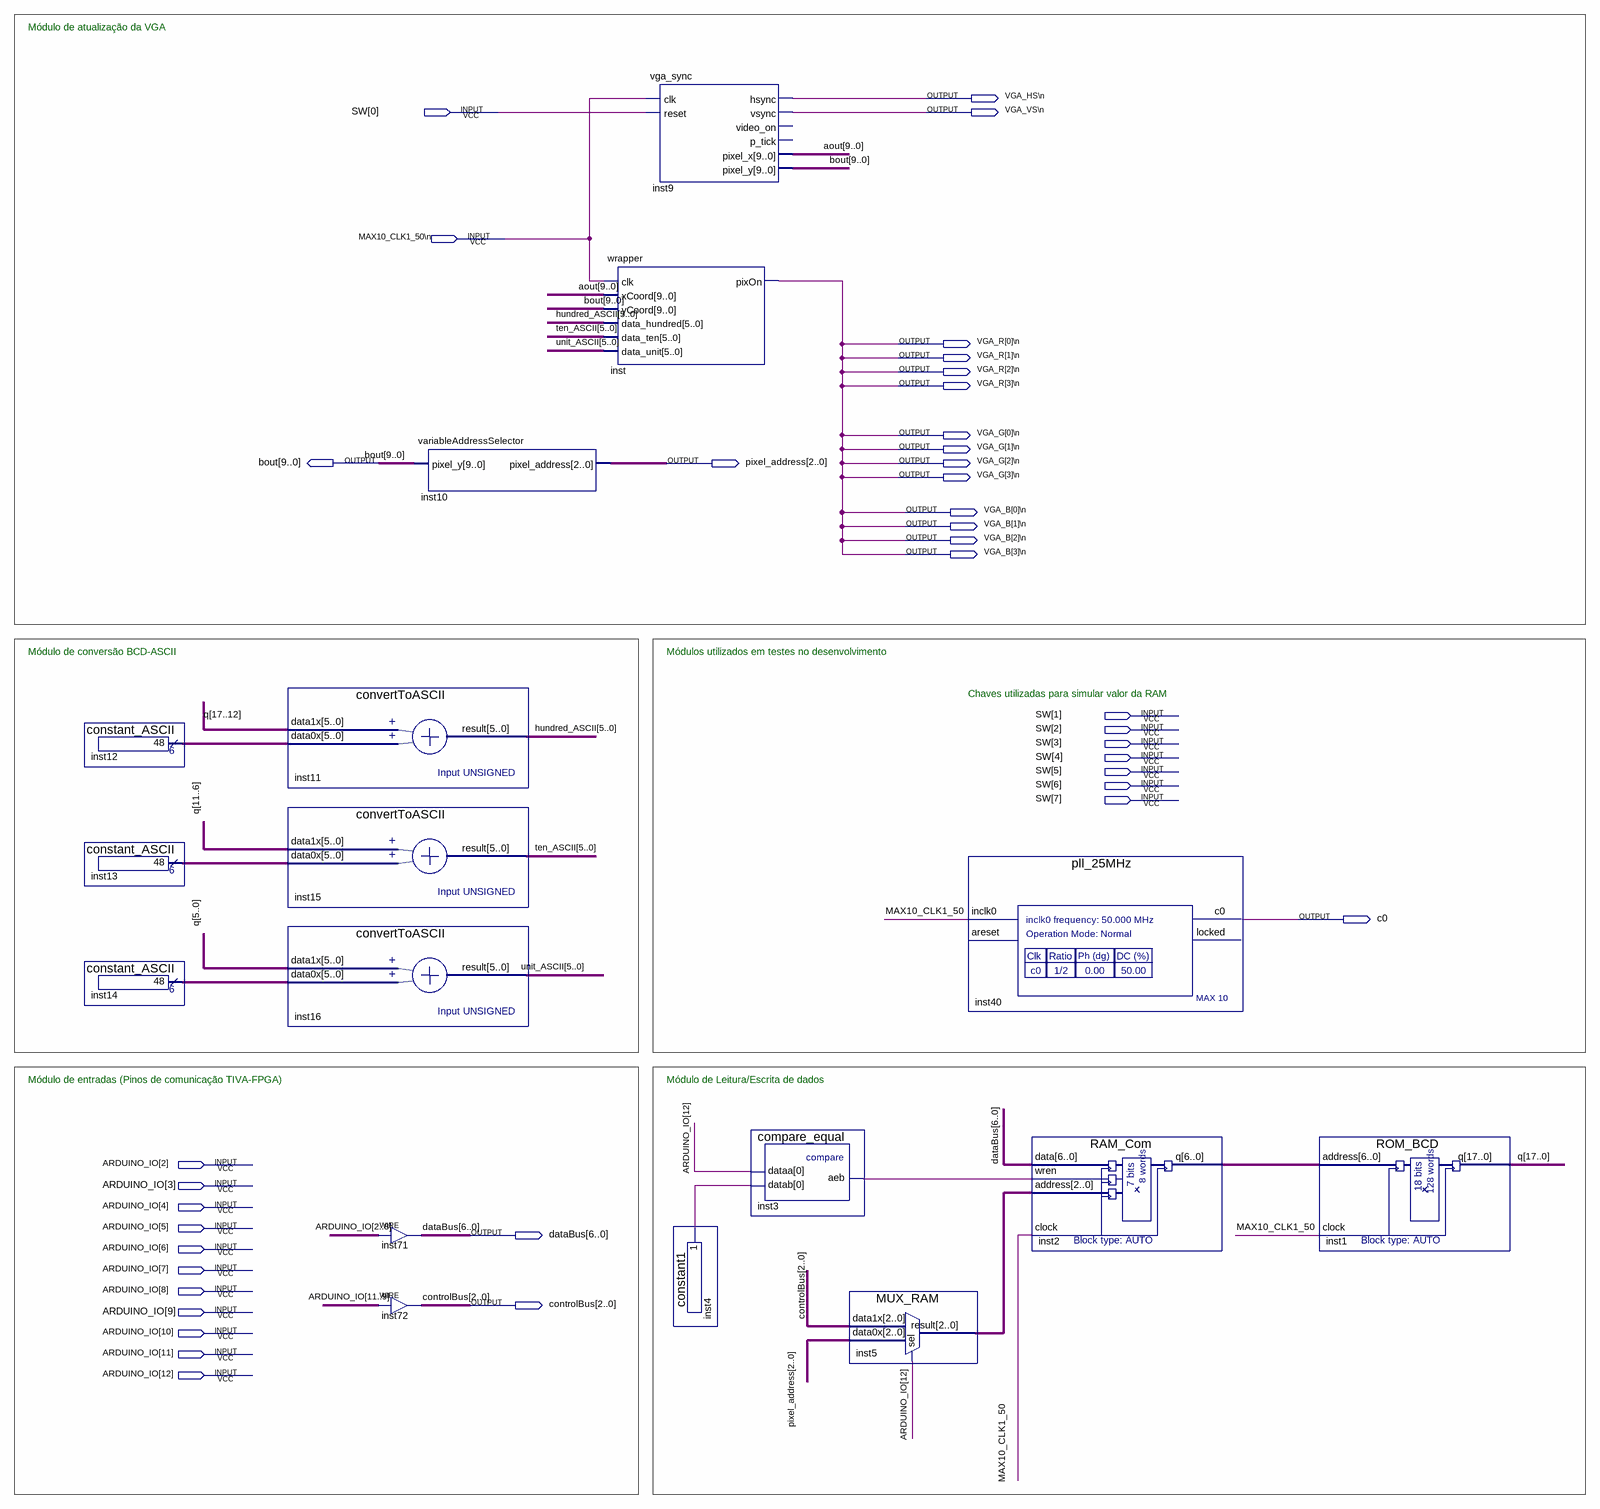
[diagram p0: schematic sheet]
// Quartus schematic Block3.bdf as structural Verilog: 17 symbols, 39 pins
module Block3 (
  input  [7:0] SW,
  input  \MAX10_CLK1_50\n ,
  input  [12:2] ARDUINO_IO,
  output \VGA_HS\n ,
  output \VGA_VS\n ,
  output \VGA_R[0]\n ,
  output \VGA_R[1]\n ,
  output \VGA_R[2]\n ,
  output \VGA_R[3]\n ,
  output \VGA_G[0]\n ,
  output \VGA_G[1]\n ,
  output [9:0] bout,
  output [2:0] pixel_address,
  output \VGA_G[2]\n ,
  output \VGA_G[3]\n ,
  output \VGA_B[0]\n ,
  output \VGA_B[1]\n ,
  output \VGA_B[2]\n ,
  output \VGA_B[3]\n ,
  output c0,
  output [6:0] dataBus,
  output [2:0] controlBus
);

  wire inst3_aeb, inst4_result, MAX10_CLK1_50;
  wire [2:0] inst5_result;
  wire [5:0] hundred_ASCII, inst12_result, inst13_result, inst14_result, ten_ASCII, unit_ASCII;
  wire [6:0] inst2_q;
  wire [9:0] aout;
  wire [17:0] q;

  constant_ASCII inst12 (.result(inst12_result));
  constant_ASCII inst13 (.result(inst13_result));
  constant_ASCII inst14 (.result(inst14_result));
  convertToASCII inst11 (.data1x(q[17:12]), .data0x(inst12_result), .result(hundred_ASCII));
  convertToASCII inst15 (.data1x(q[11:6]), .data0x(inst13_result), .result(ten_ASCII));
  convertToASCII inst16 (.data1x(q[5:0]), .data0x(inst14_result), .result(unit_ASCII));
  variableAddressSelector inst10 (.pixel_y(bout), .pixel_address(pixel_address));
  assign dataBus = {ARDUINO_IO[2], ARDUINO_IO[3], ARDUINO_IO[4], ARDUINO_IO[5], ARDUINO_IO[6], ARDUINO_IO[7], ARDUINO_IO[8]};  // WIRE inst71
  assign controlBus = ARDUINO_IO[11:9];  // WIRE inst72
  wrapper inst (
    .clk(\MAX10_CLK1_50\n ), .xCoord(aout), .yCoord(bout), .data_hundred(hundred_ASCII),
    .data_ten(ten_ASCII), .data_unit(unit_ASCII), .pixOn(\VGA_B[0]\n ));
  vga_sync inst9 (
    .clk(\MAX10_CLK1_50\n ), .reset(SW[0]), .hsync(\VGA_HS\n ), .vsync(\VGA_VS\n ), .pixel_x(aout),
    .pixel_y(bout));  // open: video_on, p_tick
  constant1 inst4 (.result(inst4_result));
  compare_equal inst3 (.dataa(ARDUINO_IO[12]), .datab(inst4_result), .aeb(inst3_aeb));
  MUX_RAM inst5 (.data1x(controlBus), .data0x(pixel_address), .sel(ARDUINO_IO[12]), .result(inst5_result));
  pll_25MHz inst40 (.inclk0(MAX10_CLK1_50), .c0(c0));  // open: areset, locked
  RAM_Com inst2 (.data(dataBus), .wren(inst3_aeb), .address(inst5_result), .clock(MAX10_CLK1_50), .q(inst2_q));
  ROM_BCD inst1 (.address(inst2_q), .clock(MAX10_CLK1_50), .q(q));

  assign \VGA_B[1]\n  = \VGA_B[0]\n ;
  assign \VGA_B[2]\n  = \VGA_B[0]\n ;
  assign \VGA_B[3]\n  = \VGA_B[0]\n ;
  assign \VGA_G[0]\n  = \VGA_B[0]\n ;
  assign \VGA_G[1]\n  = \VGA_B[0]\n ;
  assign \VGA_G[2]\n  = \VGA_B[0]\n ;
  assign \VGA_G[3]\n  = \VGA_B[0]\n ;
  assign \VGA_R[0]\n  = \VGA_B[0]\n ;
  assign \VGA_R[1]\n  = \VGA_B[0]\n ;
  assign \VGA_R[2]\n  = \VGA_B[0]\n ;
  assign \VGA_R[3]\n  = \VGA_B[0]\n ;

  // Notes on the sheet:
  //   Módulo de atualização da VGA
  //   Módulo de conversão BCD-ASCII
  //   Módulos utilizados em testes no desenvolvimento
  //   Chaves utilizadas para simular valor da RAM
  //   Módulo de entradas (Pinos de comunicação TIVA-FPGA)
  //   Módulo de Leitura/Escrita de dados
endmodule
